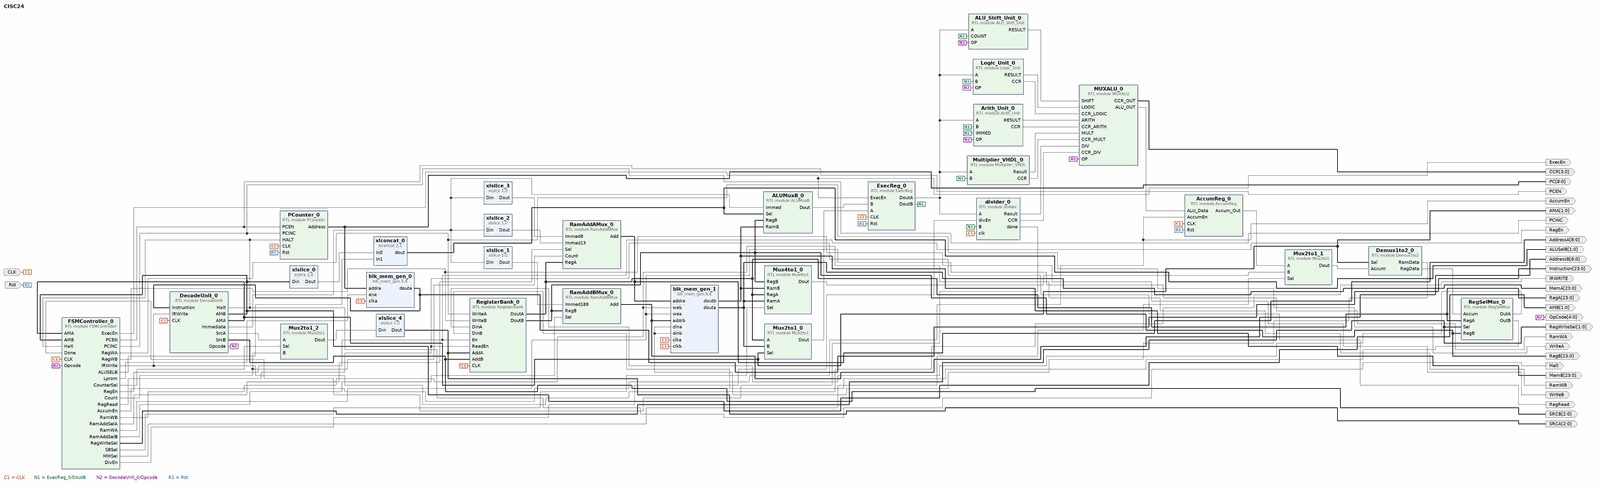
[diagram p0: block diagram of the top level, whole]
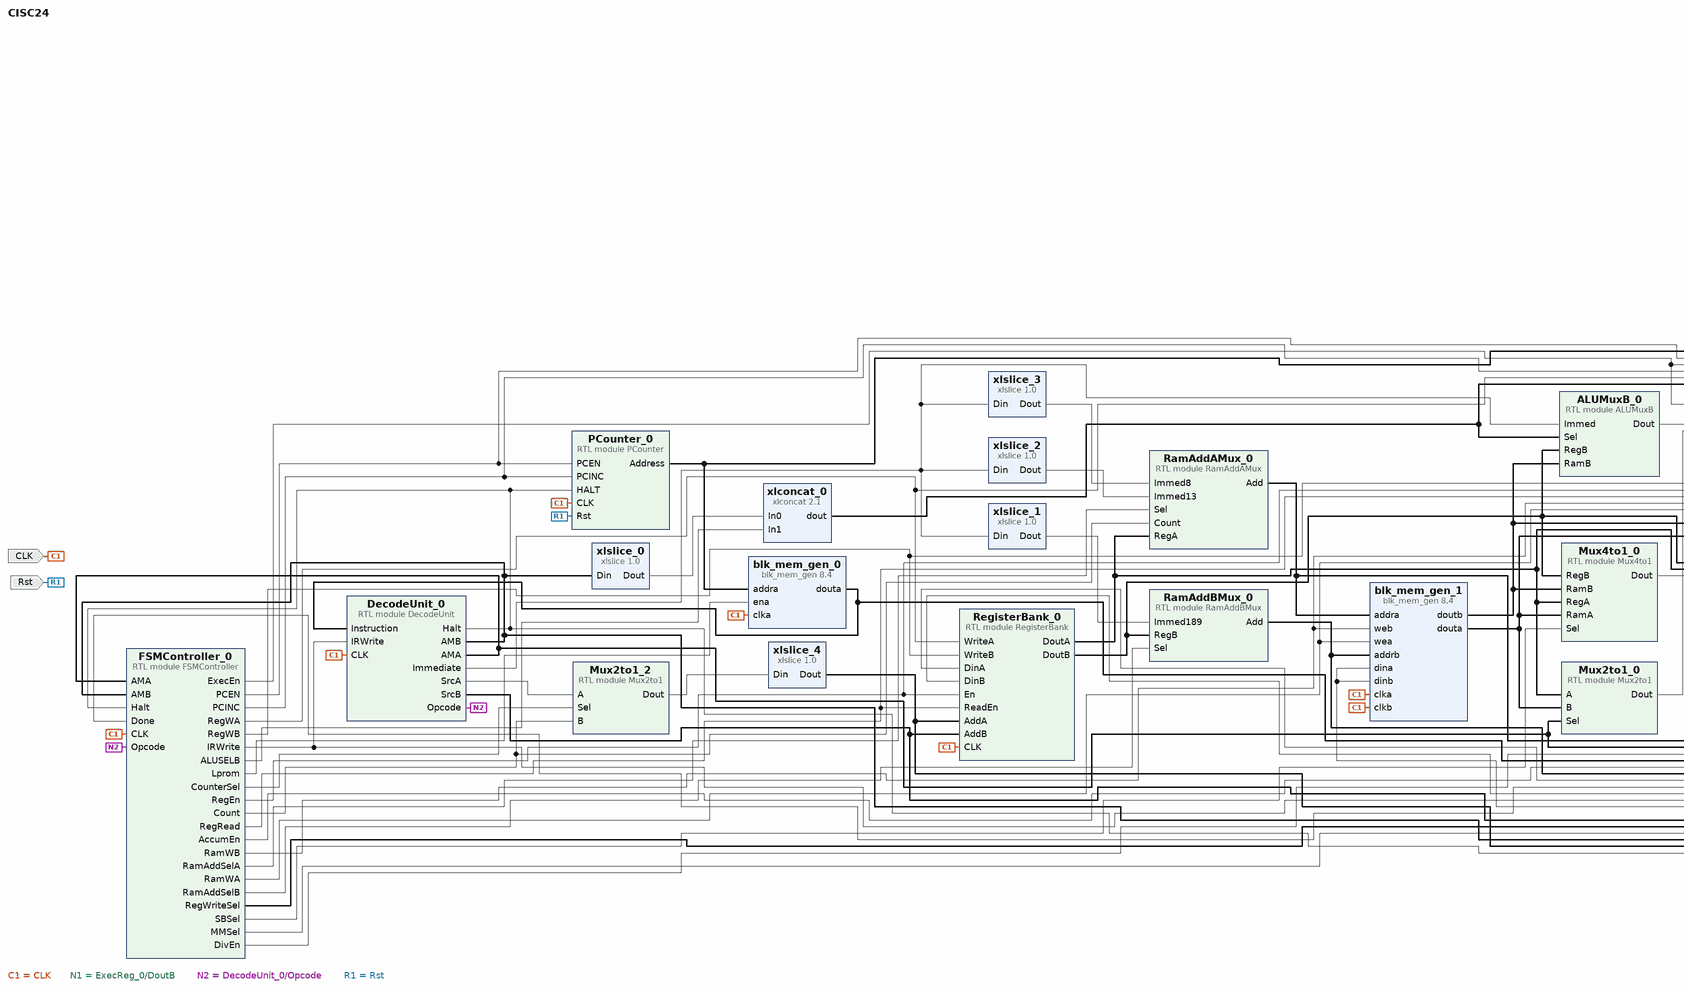
[diagram p1: block diagram of the top level, left part]
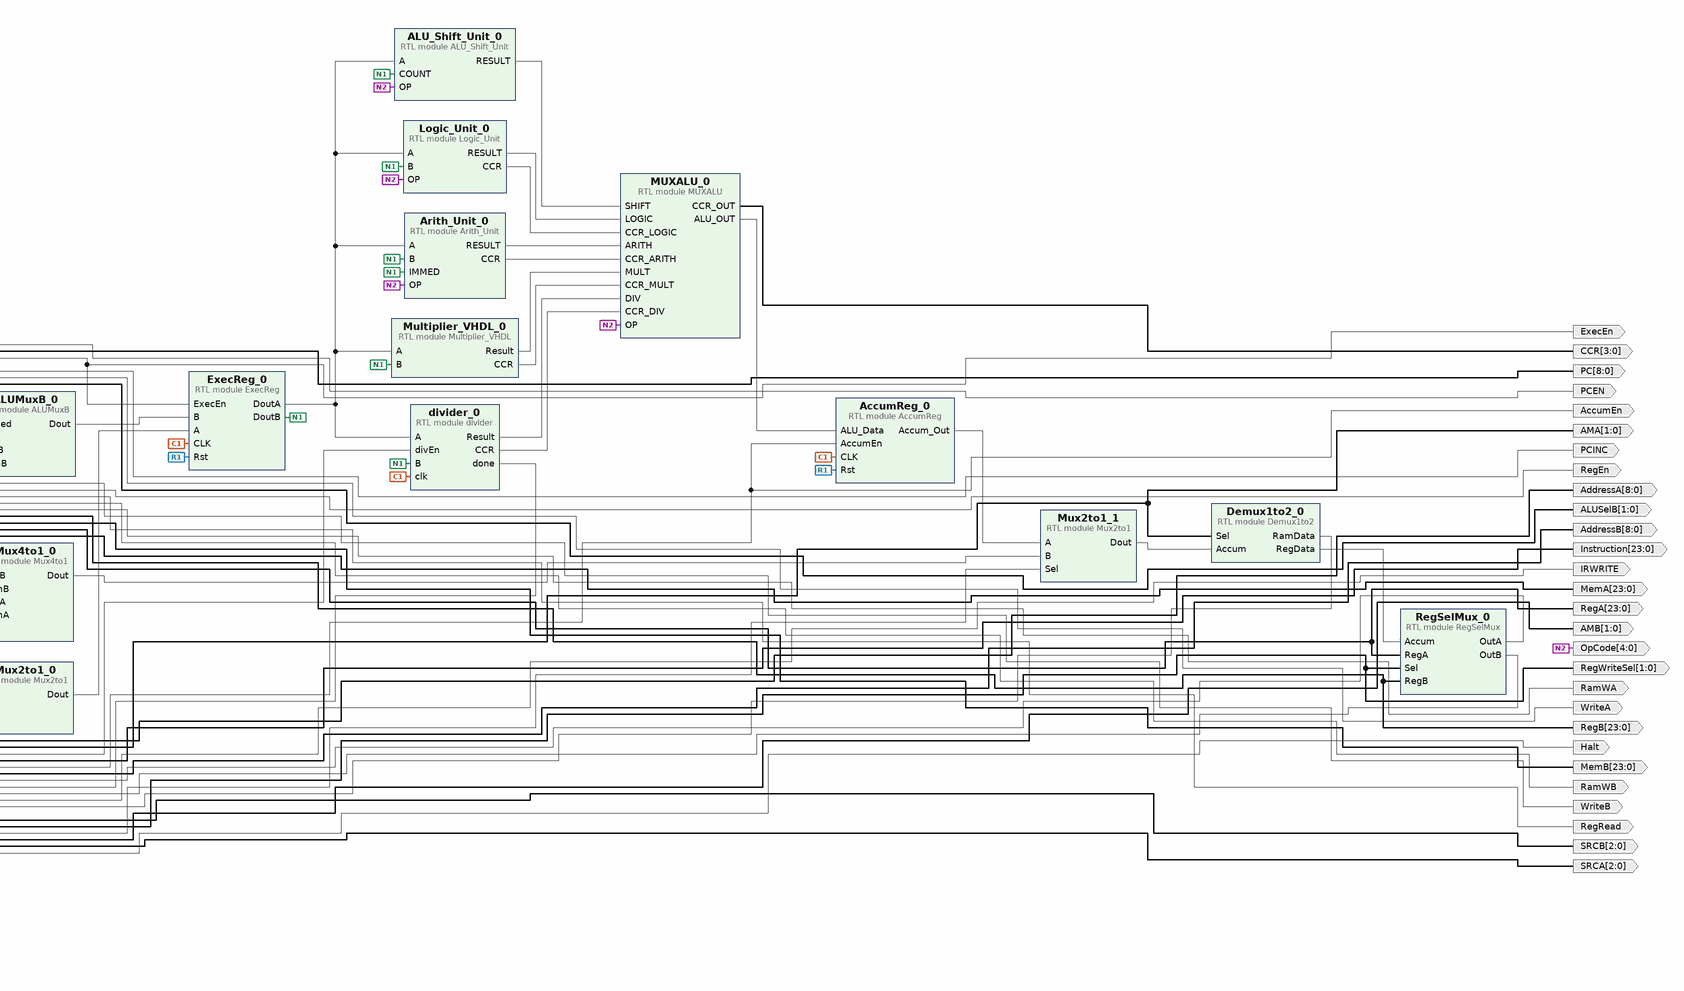
[diagram p2: block diagram of the top level, right part]
# Vivado block design CISC24, xc7a100tcsg324-1, Vivado 2017.4
create_bd_design CISC24

create_bd_port -dir O -from 8 -to 0 -type data PC
create_bd_port -dir O -type data PCEN
create_bd_port -dir O -type data PCINC
create_bd_port -dir O -type data ExecEn
create_bd_port -dir O WriteA
create_bd_port -dir O WriteB
create_bd_port -dir O RegEn
create_bd_port -dir O RegRead
create_bd_port -dir O -type data AccumEn
create_bd_port -dir O RamWB
create_bd_port -dir O -type data RamWA
create_bd_port -dir O -from 1 -to 0 -type data RegWriteSel
create_bd_port -dir O -type data IRWRITE
create_bd_port -dir O -from 23 -to 0 -type data Instruction
create_bd_port -dir O -from 1 -to 0 -type data AMA
create_bd_port -dir O -from 2 -to 0 -type data SRCB
create_bd_port -dir O -from 23 -to 0 -type data MemA
create_bd_port -dir O -from 23 -to 0 -type data MemB
create_bd_port -dir I -type clk CLK
set_property -dict {CONFIG.FREQ_HZ 100000000} [get_bd_ports CLK]
create_bd_port -dir O -from 4 -to 0 -type data OpCode
create_bd_port -dir O -from 3 -to 0 -type data CCR
create_bd_port -dir O -from 1 -to 0 -type data ALUSelB
create_bd_port -dir O -from 1 -to 0 -type data AMB
create_bd_port -dir O -from 23 -to 0 -type data RegA
create_bd_port -dir O -from 23 -to 0 -type data RegB
create_bd_port -dir O -from 8 -to 0 -type data AddressA
create_bd_port -dir O -from 8 -to 0 -type data AddressB
create_bd_port -dir I -type rst Rst
set_property -dict {CONFIG.POLARITY ACTIVE_HIGH} [get_bd_ports Rst]
create_bd_port -dir O -type data Halt
create_bd_port -dir O -from 2 -to 0 -type data SRCA

create_bd_cell -type ip -vlnv xilinx.com:ip:blk_mem_gen:8.4 blk_mem_gen_0
set_property -dict [list \
  CONFIG.Memory_Type Single_Port_ROM \
  CONFIG.Enable_32bit_Address false \
  CONFIG.Write_Width_A 24 \
  CONFIG.Write_Depth_A 512 \
  CONFIG.Register_PortA_Output_of_Memory_Primitives false \
  CONFIG.Load_Init_File true \
  CONFIG.Coe_File ../../../../../CISC24_blk_mem_gen_0_0.coe \
  CONFIG.Use_RSTA_Pin false \
  CONFIG.Port_A_Write_Rate 0 \
  CONFIG.use_bram_block Stand_Alone \
] [get_bd_cells blk_mem_gen_0]
create_bd_cell -type ip -vlnv xilinx.com:ip:blk_mem_gen:8.4 blk_mem_gen_1
set_property -dict [list \
  CONFIG.Memory_Type True_Dual_Port_RAM \
  CONFIG.Enable_32bit_Address false \
  CONFIG.Use_Byte_Write_Enable false \
  CONFIG.Write_Width_A 24 \
  CONFIG.Write_Depth_A 512 \
  CONFIG.Read_Width_A 24 \
  CONFIG.Operating_Mode_A WRITE_FIRST \
  CONFIG.Enable_A Always_Enabled \
  CONFIG.Write_Width_B 24 \
  CONFIG.Read_Width_B 24 \
  CONFIG.Operating_Mode_B WRITE_FIRST \
  CONFIG.Enable_B Always_Enabled \
  CONFIG.Register_PortA_Output_of_Memory_Primitives true \
  CONFIG.Register_PortB_Output_of_Memory_Primitives true \
  CONFIG.Fill_Remaining_Memory_Locations true \
  CONFIG.Use_RSTA_Pin false \
  CONFIG.Port_B_Clock 100 \
  CONFIG.Port_B_Write_Rate 50 \
  CONFIG.Port_B_Enable_Rate 100 \
  CONFIG.use_bram_block Stand_Alone \
] [get_bd_cells blk_mem_gen_1]
create_bd_cell -type module -reference Demux1to2 Demux1to2_0
create_bd_cell -type module -reference ALU_Shift_Unit ALU_Shift_Unit_0
create_bd_cell -type module -reference Mux2to1 Mux2to1_0
create_bd_cell -type module -reference RegSelMux RegSelMux_0
create_bd_cell -type ip -vlnv xilinx.com:ip:xlconcat:2.1 xlconcat_0
create_bd_cell -type ip -vlnv xilinx.com:ip:xlslice:1.0 xlslice_0
set_property -dict {CONFIG.DIN_TO 0 CONFIG.DIN_FROM 0 CONFIG.DIN_WIDTH 2} [get_bd_cells xlslice_0]
create_bd_cell -type ip -vlnv xilinx.com:ip:xlslice:1.0 xlslice_1
set_property -dict {CONFIG.DIN_TO 9 CONFIG.DIN_FROM 18 CONFIG.DIN_WIDTH 19 CONFIG.DOUT_WIDTH 10} [get_bd_cells xlslice_1]
create_bd_cell -type ip -vlnv xilinx.com:ip:xlslice:1.0 xlslice_2
set_property -dict {CONFIG.DIN_TO 0 CONFIG.DIN_FROM 13 CONFIG.DIN_WIDTH 19 CONFIG.DOUT_WIDTH 14} [get_bd_cells xlslice_2]
create_bd_cell -type ip -vlnv xilinx.com:ip:xlslice:1.0 xlslice_3
set_property -dict {CONFIG.DIN_TO 0 CONFIG.DIN_FROM 8 CONFIG.DIN_WIDTH 19 CONFIG.DOUT_WIDTH 9} [get_bd_cells xlslice_3]
create_bd_cell -type module -reference Mux2to1 Mux2to1_1
create_bd_cell -type module -reference Mux4to1 Mux4to1_0
create_bd_cell -type module -reference MUXALU MUXALU_0
create_bd_cell -type module -reference Multiplier_VHDL Multiplier_VHDL_0
create_bd_cell -type module -reference AccumReg AccumReg_0
create_bd_cell -type module -reference ExecReg ExecReg_0
create_bd_cell -type module -reference divider divider_0
create_bd_cell -type module -reference ALUMuxB ALUMuxB_0
create_bd_cell -type module -reference Arith_Unit Arith_Unit_0
create_bd_cell -type module -reference Logic_Unit Logic_Unit_0
create_bd_cell -type module -reference RegisterBank RegisterBank_0
create_bd_cell -type module -reference Mux2to1 Mux2to1_2
create_bd_cell -type ip -vlnv xilinx.com:ip:xlslice:1.0 xlslice_4
set_property -dict {CONFIG.DIN_TO 0 CONFIG.DIN_FROM 2 CONFIG.DIN_WIDTH 24 CONFIG.DOUT_WIDTH 3} [get_bd_cells xlslice_4]
create_bd_cell -type module -reference RamAddBMux RamAddBMux_0
create_bd_cell -type module -reference PCounter PCounter_0
create_bd_cell -type module -reference DecodeUnit DecodeUnit_0
create_bd_cell -type module -reference RamAddAMux RamAddAMux_0
create_bd_cell -type module -reference FSMController FSMController_0

# ---- connections ----

connect_bd_net [get_bd_pins PCounter_0/Address] [get_bd_ports PC] [get_bd_pins blk_mem_gen_0/addra]
connect_bd_net [get_bd_pins FSMController_0/PCEN] [get_bd_ports PCEN] [get_bd_pins PCounter_0/PCEN]
connect_bd_net [get_bd_pins FSMController_0/PCINC] [get_bd_ports PCINC] [get_bd_pins PCounter_0/PCINC]
connect_bd_net [get_bd_pins FSMController_0/ExecEn] [get_bd_ports ExecEn] [get_bd_pins ExecReg_0/ExecEn]
connect_bd_net [get_bd_pins FSMController_0/RegWA] [get_bd_ports WriteA] [get_bd_pins RegisterBank_0/WriteA]
connect_bd_net [get_bd_pins FSMController_0/RegWB] [get_bd_ports WriteB] [get_bd_pins RegisterBank_0/WriteB]
connect_bd_net [get_bd_pins FSMController_0/RegEn] [get_bd_ports RegEn] [get_bd_pins RegisterBank_0/En]
connect_bd_net [get_bd_pins FSMController_0/RegRead] [get_bd_ports RegRead] [get_bd_pins RegisterBank_0/ReadEn]
connect_bd_net [get_bd_pins FSMController_0/AccumEn] [get_bd_ports AccumEn] [get_bd_pins AccumReg_0/AccumEn]
connect_bd_net [get_bd_pins FSMController_0/RamWB] [get_bd_ports RamWB] [get_bd_pins blk_mem_gen_1/web]
connect_bd_net [get_bd_pins FSMController_0/RamWA] [get_bd_ports RamWA] [get_bd_pins blk_mem_gen_1/wea]
connect_bd_net [get_bd_pins FSMController_0/Lprom] [get_bd_pins blk_mem_gen_0/ena]
connect_bd_net [get_bd_pins FSMController_0/RegWriteSel] [get_bd_ports RegWriteSel] [get_bd_pins RegSelMux_0/Sel]
connect_bd_net [get_bd_pins Mux2to1_0/Dout] [get_bd_pins ExecReg_0/A]
connect_bd_net [get_bd_pins FSMController_0/IRWrite] [get_bd_ports IRWRITE] [get_bd_pins DecodeUnit_0/IRWrite]
connect_bd_net [get_bd_pins blk_mem_gen_0/douta] [get_bd_ports Instruction] [get_bd_pins DecodeUnit_0/Instruction]
connect_bd_net [get_bd_pins DecodeUnit_0/AMA] \
  [get_bd_ports AMA] [get_bd_pins Demux1to2_0/Sel] [get_bd_pins Mux2to1_0/Sel] [get_bd_pins FSMController_0/AMA]
connect_bd_net [get_bd_pins DecodeUnit_0/Immediate] \
  [get_bd_pins xlslice_1/Din] [get_bd_pins xlslice_2/Din] [get_bd_pins xlslice_3/Din] [get_bd_pins ALUMuxB_0/Immed]
connect_bd_net [get_bd_pins DecodeUnit_0/SrcB] [get_bd_ports SRCB] [get_bd_pins RegisterBank_0/AddB]
connect_bd_net [get_bd_pins RegSelMux_0/OutA] [get_bd_pins RegisterBank_0/DinA]
connect_bd_net [get_bd_pins RegSelMux_0/OutB] [get_bd_pins RegisterBank_0/DinB]
connect_bd_net [get_bd_pins blk_mem_gen_1/douta] [get_bd_ports MemA] [get_bd_pins Mux2to1_0/B] [get_bd_pins Mux4to1_0/RamA]
connect_bd_net [get_bd_pins blk_mem_gen_1/doutb] [get_bd_ports MemB] [get_bd_pins Mux4to1_0/RamB] [get_bd_pins ALUMuxB_0/RamB]
connect_bd_net [get_bd_ports CLK] \
  [get_bd_pins blk_mem_gen_0/clka] [get_bd_pins blk_mem_gen_1/clka] [get_bd_pins blk_mem_gen_1/clkb] \
  [get_bd_pins AccumReg_0/CLK] [get_bd_pins ExecReg_0/CLK] [get_bd_pins divider_0/clk] [get_bd_pins RegisterBank_0/CLK] \
  [get_bd_pins PCounter_0/CLK] [get_bd_pins DecodeUnit_0/CLK] [get_bd_pins FSMController_0/CLK]
connect_bd_net [get_bd_pins Logic_Unit_0/RESULT] [get_bd_pins MUXALU_0/LOGIC]
connect_bd_net [get_bd_pins Arith_Unit_0/RESULT] [get_bd_pins MUXALU_0/ARITH]
connect_bd_net [get_bd_pins ALU_Shift_Unit_0/RESULT] [get_bd_pins MUXALU_0/SHIFT]
connect_bd_net [get_bd_pins Arith_Unit_0/CCR] [get_bd_pins MUXALU_0/CCR_ARITH]
connect_bd_net [get_bd_pins Logic_Unit_0/CCR] [get_bd_pins MUXALU_0/CCR_LOGIC]
connect_bd_net [get_bd_pins ExecReg_0/DoutA] \
  [get_bd_pins ALU_Shift_Unit_0/A] [get_bd_pins Multiplier_VHDL_0/A] [get_bd_pins divider_0/A] [get_bd_pins Arith_Unit_0/A] \
  [get_bd_pins Logic_Unit_0/A]
connect_bd_net [get_bd_pins ExecReg_0/DoutB] \
  [get_bd_pins ALU_Shift_Unit_0/COUNT] [get_bd_pins Multiplier_VHDL_0/B] [get_bd_pins divider_0/B] \
  [get_bd_pins Arith_Unit_0/B] [get_bd_pins Arith_Unit_0/IMMED] [get_bd_pins Logic_Unit_0/B]
connect_bd_net [get_bd_pins DecodeUnit_0/Opcode] \
  [get_bd_ports OpCode] [get_bd_pins ALU_Shift_Unit_0/OP] [get_bd_pins MUXALU_0/OP] [get_bd_pins Arith_Unit_0/OP] \
  [get_bd_pins Logic_Unit_0/OP] [get_bd_pins FSMController_0/Opcode]
connect_bd_net [get_bd_pins MUXALU_0/ALU_OUT] [get_bd_pins AccumReg_0/ALU_Data]
connect_bd_net [get_bd_pins MUXALU_0/CCR_OUT] [get_bd_ports CCR]
connect_bd_net [get_bd_pins ALUMuxB_0/Dout] [get_bd_pins ExecReg_0/B]
connect_bd_net [get_bd_pins FSMController_0/ALUSELB] [get_bd_pins xlconcat_0/In1]
connect_bd_net [get_bd_pins xlconcat_0/dout] [get_bd_ports ALUSelB] [get_bd_pins ALUMuxB_0/Sel]
connect_bd_net [get_bd_pins DecodeUnit_0/AMB] [get_bd_ports AMB] [get_bd_pins xlslice_0/Din] [get_bd_pins FSMController_0/AMB]
connect_bd_net [get_bd_pins xlslice_0/Dout] [get_bd_pins xlconcat_0/In0]
connect_bd_net [get_bd_pins RegisterBank_0/DoutA] \
  [get_bd_ports RegA] [get_bd_pins Mux2to1_0/A] [get_bd_pins RegSelMux_0/RegA] [get_bd_pins Mux4to1_0/RegA] \
  [get_bd_pins RamAddAMux_0/RegA]
connect_bd_net [get_bd_pins RegisterBank_0/DoutB] \
  [get_bd_ports RegB] [get_bd_pins RegSelMux_0/RegB] [get_bd_pins Mux4to1_0/RegB] [get_bd_pins ALUMuxB_0/RegB] \
  [get_bd_pins RamAddBMux_0/RegB]
connect_bd_net [get_bd_pins xlslice_1/Dout] [get_bd_pins RamAddBMux_0/Immed189]
connect_bd_net [get_bd_pins xlslice_2/Dout] [get_bd_pins RamAddAMux_0/Immed13]
connect_bd_net [get_bd_pins xlslice_3/Dout] [get_bd_pins RamAddAMux_0/Immed8]
connect_bd_net [get_bd_pins AccumReg_0/Accum_Out] [get_bd_pins Mux2to1_1/A]
connect_bd_net [get_bd_pins Mux4to1_0/Dout] [get_bd_pins Mux2to1_1/B]
connect_bd_net [get_bd_pins Mux2to1_1/Dout] [get_bd_pins Demux1to2_0/Accum]
connect_bd_net [get_bd_pins FSMController_0/RamAddSelA] [get_bd_pins RamAddAMux_0/Sel]
connect_bd_net [get_bd_pins FSMController_0/RamAddSelB] [get_bd_pins RamAddBMux_0/Sel]
connect_bd_net [get_bd_pins FSMController_0/SBSel] [get_bd_pins Mux4to1_0/Sel]
connect_bd_net [get_bd_pins FSMController_0/MMSel] [get_bd_pins Mux2to1_1/Sel]
connect_bd_net [get_bd_pins RamAddAMux_0/Add] [get_bd_ports AddressA] [get_bd_pins blk_mem_gen_1/addra]
connect_bd_net [get_bd_pins RamAddBMux_0/Add] [get_bd_ports AddressB] [get_bd_pins blk_mem_gen_1/addrb]
connect_bd_net [get_bd_pins Multiplier_VHDL_0/Result] [get_bd_pins MUXALU_0/MULT]
connect_bd_net [get_bd_pins divider_0/Result] [get_bd_pins MUXALU_0/DIV]
connect_bd_net [get_bd_pins divider_0/CCR] [get_bd_pins MUXALU_0/CCR_DIV]
connect_bd_net [get_bd_pins Multiplier_VHDL_0/CCR] [get_bd_pins MUXALU_0/CCR_MULT]
connect_bd_net [get_bd_pins FSMController_0/DivEn] [get_bd_pins divider_0/divEn]
connect_bd_net [get_bd_ports Rst] [get_bd_pins AccumReg_0/Rst] [get_bd_pins ExecReg_0/Rst] [get_bd_pins PCounter_0/Rst]
connect_bd_net [get_bd_pins DecodeUnit_0/Halt] [get_bd_ports Halt] [get_bd_pins PCounter_0/HALT] [get_bd_pins FSMController_0/Halt]
connect_bd_net [get_bd_pins divider_0/done] [get_bd_pins FSMController_0/Done]
connect_bd_net -net AutoIncMux_0_B [get_bd_pins Demux1to2_0/RamData] [get_bd_pins blk_mem_gen_1/dina] [get_bd_pins blk_mem_gen_1/dinb]
connect_bd_net [get_bd_pins Demux1to2_0/RegData] [get_bd_pins RegSelMux_0/Accum]
connect_bd_net [get_bd_pins FSMController_0/CounterSel] [get_bd_pins Mux2to1_2/Sel]
connect_bd_net [get_bd_pins FSMController_0/Count] [get_bd_pins Mux2to1_2/B] [get_bd_pins RamAddAMux_0/Count]
connect_bd_net [get_bd_pins DecodeUnit_0/SrcA] [get_bd_pins Mux2to1_2/A]
connect_bd_net [get_bd_pins Mux2to1_2/Dout] [get_bd_pins xlslice_4/Din]
connect_bd_net [get_bd_pins xlslice_4/Dout] [get_bd_ports SRCA] [get_bd_pins RegisterBank_0/AddA]

validate_bd_design
save_bd_design
